# Altium schematic sheet Sheet2.SchDoc
size A3; SheetNumber: 1; SheetTotal: 1
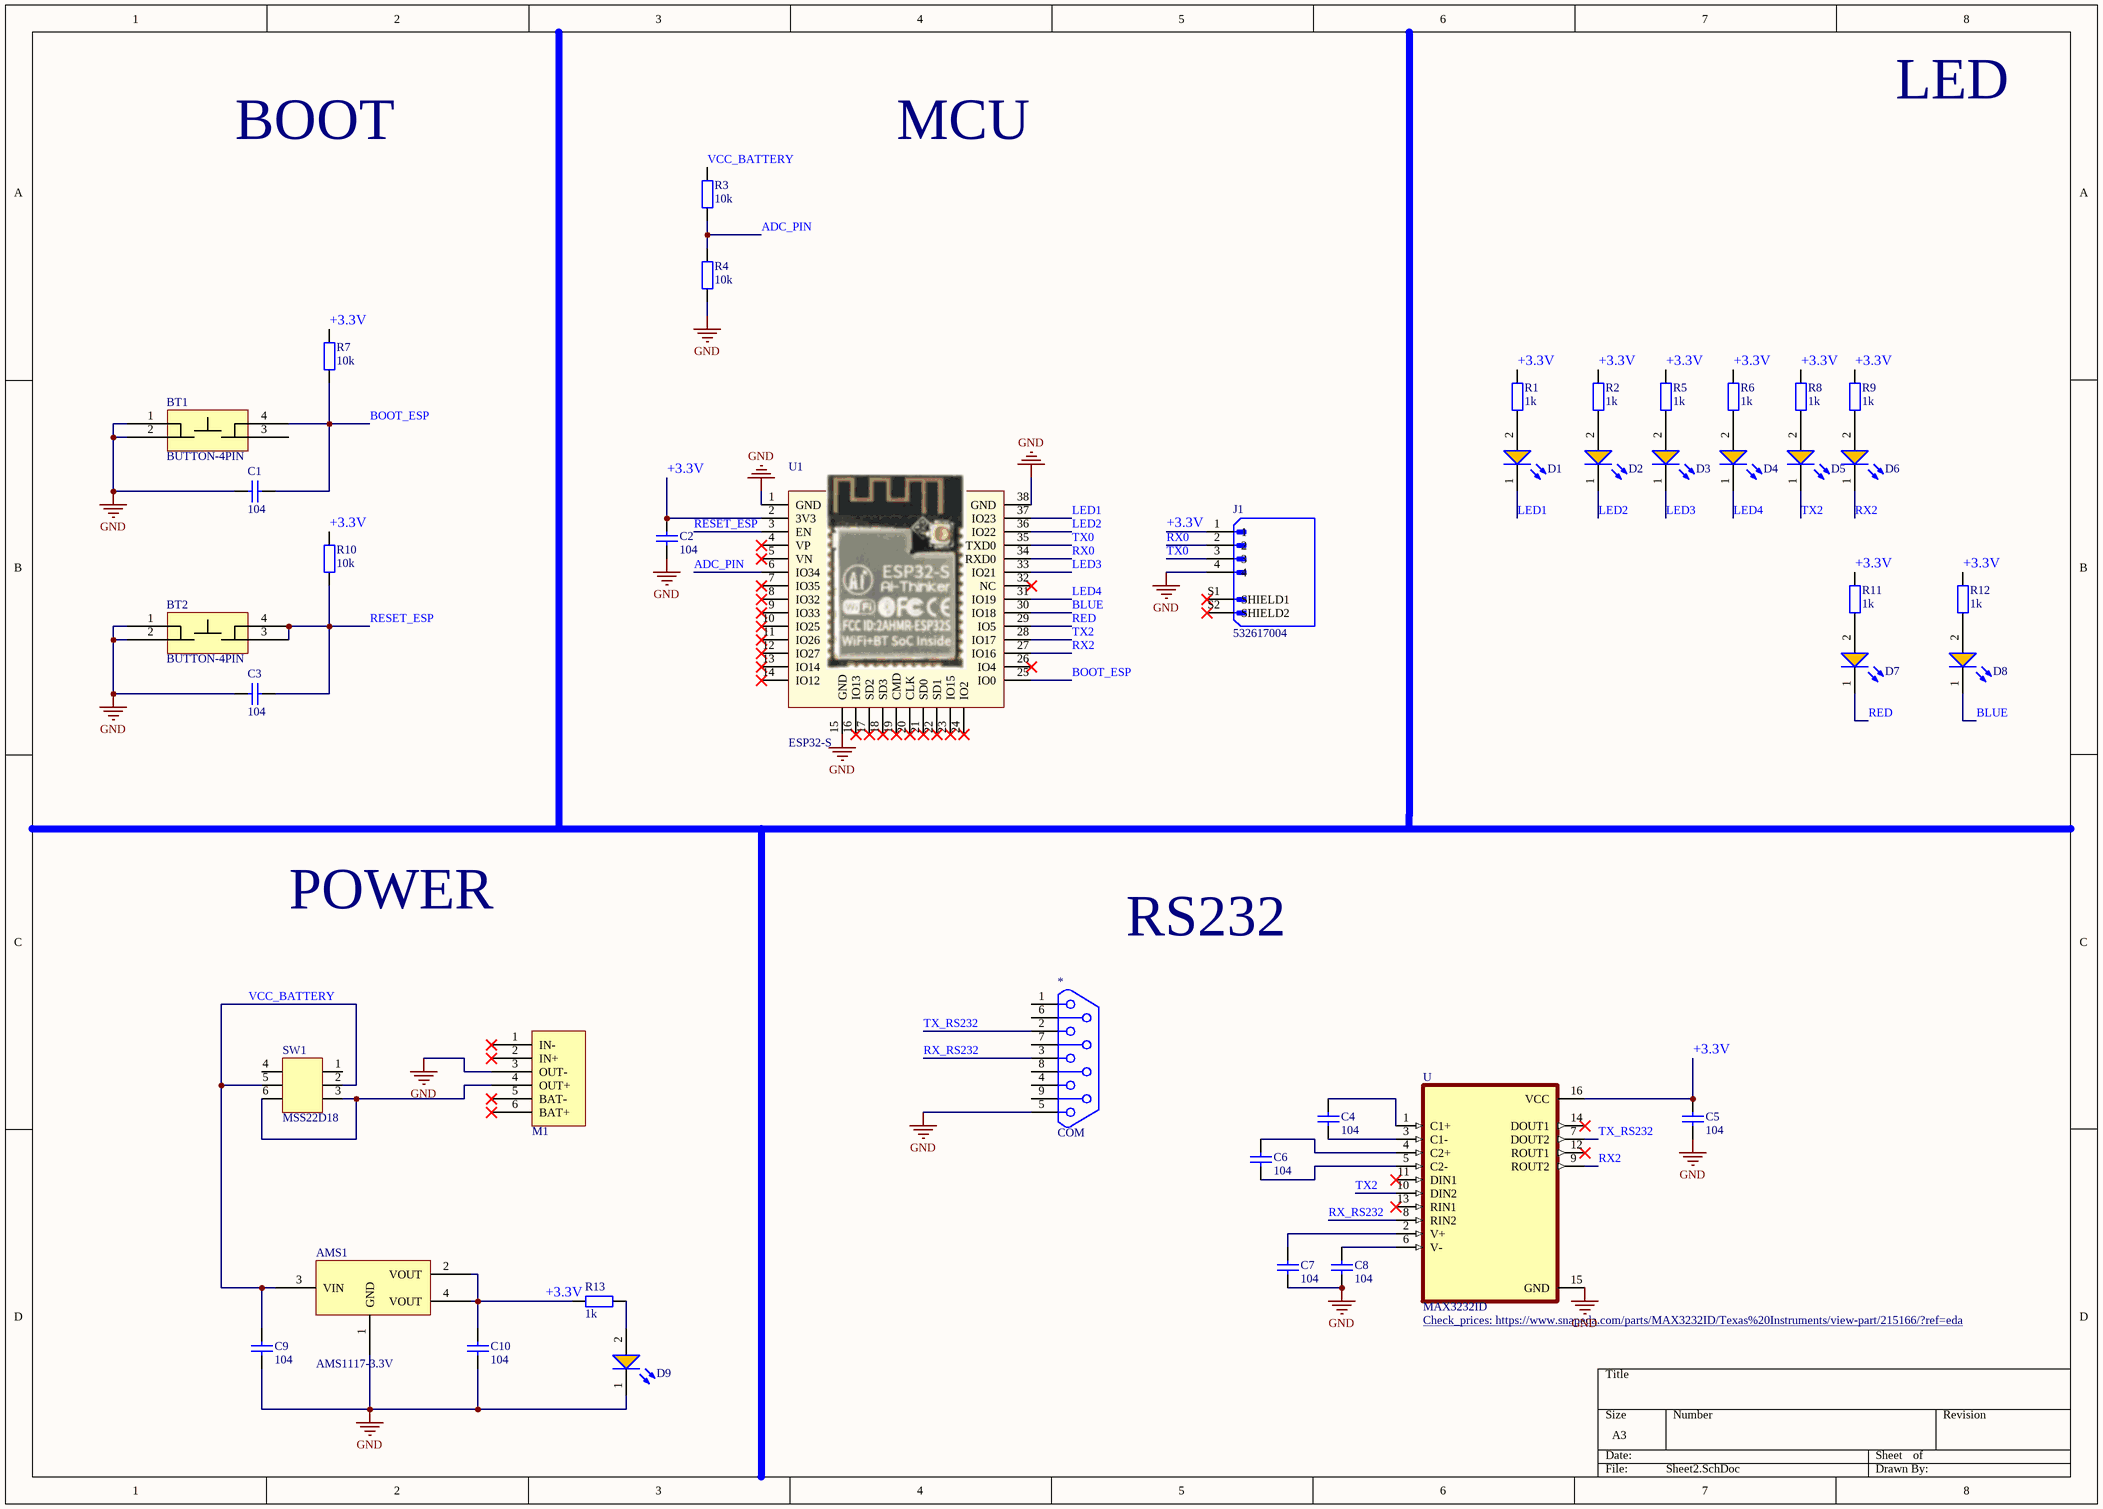
[diagram p0: Sheet2.SchDoc]

## Parts
*  COM  [DSB 9-M]
AMS1  AMS1117-3.3V  [SOT223]
BT1  BUTTON-4PIN  [BUTTON-3X3X1.5-4PIN]
BT2  BUTTON-4PIN  [BUTTON-3X3X1.5-4PIN]
C1  104  [tu 0603]
C2  104  [tu 0603]
C3  104  [tu 0603]
C4  104  [tu 0603]
C5  104  [tu 0603]
C6  104  [tu 0603]
C7  104  [tu 0603]
C8  104  [tu 0603]
C9  104  [tu 0603]
C10  104  [tu 0603]
D1  Amber, 2V, 120°  [WL-SMSW_0603_L1.6W1H0.6]  (value not drawn)
D2  Amber, 2V, 120°  [WL-SMSW_0603_L1.6W1H0.6]  (value not drawn)
D3  Amber, 2V, 120°  [WL-SMSW_0603_L1.6W1H0.6]  (value not drawn)
D4  Amber, 2V, 120°  [WL-SMSW_0603_L1.6W1H0.6]  (value not drawn)
D5  Amber, 2V, 120°  [WL-SMSW_0603_L1.6W1H0.6]  (value not drawn)
D6  Amber, 2V, 120°  [WL-SMSW_0603_L1.6W1H0.6]  (value not drawn)
D7  Amber, 2V, 120°  [WL-SMSW_0603_L1.6W1H0.6]  (value not drawn)
D8  Amber, 2V, 120°  [WL-SMSW_0603_L1.6W1H0.6]  (value not drawn)
D9  Amber, 2V, 120°  [WL-SMSW_0603_L1.6W1H0.6]  (value not drawn)
J1  532617004  [MOLEX_532617004]
M1  MODULE-TP4056  [MODULE-TP4056]  (value not drawn)
R1  1k  [tro smd 0603]
R2  1k  [tro smd 0603]
R3  10k  [Tro SMD 0805]
R4  10k  [Tro SMD 0805]
R5  1k  [tro smd 0603]
R6  1k  [tro smd 0603]
R7  10k  [tro smd 0603]
R8  1k  [tro smd 0603]
R9  1k  [tro smd 0603]
R10  10k  [tro smd 0603]
R11  1k  [tro smd 0603]
R12  1k  [tro smd 0603]
R13  1k  [tro smd 0603]
SW1  MSS22D18  [MSS22D18 SMD]
U  MAX3232ID  [SOIC127P600X175-16N]
U1  ESP32-S  [ESP-32WR]

## Nets
GND: *.5 AMS1.1(GND) BT1.1 BT1.2 BT2.1 BT2.2 C1.1 C2.2 C3.1 C5.2 C7.2 C8.2 C9.2 C10.2 D9.1(K) J1.4 M1.3(OUT-) R4.1 U.15(GND) U1.1(GND) U1.15(GND) U1.38(GND)
+3.3V: AMS1.2(VOUT) AMS1.4(VOUT) C2.1 C5.1 C10.1 J1.1 R1.2 R2.2 R5.2 R6.2 R7.2 R8.2 R9.2 R10.2 R11.2 R12.2 R13.2 U.16(VCC) U1.2(3V3)
ADC_PIN: R3.1 R4.2 U1.6(IO34)
BLUE: D8.1(K) U1.30(IO18)
BOOT_ESP: BT1.4 C1.2 R7.1 U1.25(IO0)
LED1: D1.1(K) U1.37(IO23)
LED2: D2.1(K) U1.36(IO22)
LED3: D3.1(K) U1.33(IO21)
LED4: D4.1(K) U1.31(IO19)
RED: D7.1(K) U1.29(IO5)
RESET_ESP: BT2.3 BT2.4 C3.2 R10.1 U1.3(EN)
RX0: J1.2 U1.34(RXD0)
RX2: D6.1(K) U.9(ROUT2) U1.27(IO16)
RX_RS232: *.3 U.8(RIN2)
TX0: J1.3 U1.35(TXD0)
TX2: D5.1(K) U.10(DIN2) U1.28(IO17)
TX_RS232: *.2 U.7(DOUT2)
VCC_BATTERY: AMS1.3(VIN) C9.1 R3.2 SW1.2 SW1.5
NetC4_1: C4.1 U.1(C1+)
NetC4_2: C4.2 U.3(C1-)
NetC6_1: C6.1 U.4(C2+)
NetC6_2: C6.2 U.5(C2-)
NetC7_1: C7.1 U.2(V+)
NetC8_1: C8.1 U.6(V-)
NetD1_2: D1.2(A) R1.1
NetD2_2: D2.2(A) R2.1
NetD3_2: D3.2(A) R5.1
NetD4_2: D4.2(A) R6.1
NetD5_2: D5.2(A) R8.1
NetD6_2: D6.2(A) R9.1
NetD7_2: D7.2(A) R11.1
NetD8_2: D8.2(A) R12.1
NetD9_2: D9.2(A) R13.1
NetM1_4: M1.4(OUT+) SW1.3 SW1.6

Not connected (* = marked no-connect by the designer): * 1 4 6 7 8 9; BT1 3(14); J1 S1(SHIELD1)* S2(SHIELD2)*; M1 1(IN-)* 2(IN+)* 5(BAT-)* 6(BAT+)*; SW1 1(77) 4; U 11(DIN1)* 12(ROUT1)* 13(RIN1)* 14(DOUT1)*; U1 4(VP)* 5(VN)* 7(IO35)* 8(IO32)* 9(IO33)* 10(IO25)* 11(IO26)* 12(IO27)* 13(IO14)* 14(IO12)* 16(IO13)* 17(SD2)* 18(SD3)* 19(CMD)* 20(CLK)* 21(SD0)* 22(SD1)* 23(IO15)* 24(IO2)* 26(IO4)* 32(NC)*

## Notes on the sheet
- LED
- BOOT
- MCU
- POWER
- RS232

## Library data of the parts
AMS1 = AMS1117 SMD: Dán; Value: AMS1117-3.3V SOT223; Don_Vi: Con; Ma_Hang: MH000596; Ghi_Chu: *; Kieu_Chan: *; Chung_Loai: Dán
C1-C10 = Tu 0603 104 50V 10%: Dán; Don_Vi: Con; So_Chan: 2; Ten_Linh_Kien: Tụ 0603 104-100nF 10% 50V; Ma_Hang: MH004568; Chung_Loai: Dán; Kieu_Chan: *
D1-D9 = 155060AS73200: WL-SMSW Mono-color Side View Waterclear, size 0603, Amber, 2V, 120°; Manufacturer: Wurth Elektronik; Case/Size Code: 0603; Chip Technology: AlInGaP; Dominant Wavelength: 605nm; Luminous Intensity: 120mcd; Peak Wavelength: 609nm; Manufacturer Part Number: 155060AS73200; Category: Signal LEDs; Match Code: WL-SMSW; ComponentLink1Description: Website Link; ComponentLink1URL: https://www.we-online.com/redexpert/article/155060AS73200?ad; ComponentLink2Description: Datasheet Link; ComponentLink2URL: https://www.we-online.com/redexpert/spec/155060AS73200?ad; Mount: Surface Mount; Operating Temperature Max: 85°C; Operating Temperature Min: -40°C; Packaging: Tape and Reel; Length: 1.6mm; Width: 1mm; Height: 0.6mm; Emitting Color: Amber; Forward Voltage: 2V; Viewing Angle: 120°
R1 R2 R5-R13 = Tro 0603 5% 1k: Dán; Don_Vi: Con; So_Chan: 2; Ten_Linh_Kien: Trở 0603 5% 1k; Ma_Hang: MH006319; Chung_Loai: Dán; Kieu_Chan: *
R3 R4 = Tro 0805 5% 82k: Dán; Don_Vi: Con; So_Chan: 2; Ten_Linh_Kien: Trở 0805 5% 82k; Ma_Hang: MH005329; Chung_Loai: Dán; Kieu_Chan: *
SW1 = MSS22D18: SMD
U = MAX3232ID: 3-V to 5.5-V multichannel RS-232 line driver & receiver 16-SOIC -40 to 85; MF: Texas Instruments; Price: None; Value: *; Package: SOIC-16 Texas Instruments; Mouser-Purchase-URL: https://snapeda.com/shop?store=Mouser&id=215166; SnapEDA_Link: https://www.snapeda.com/parts/MAX3232ID/Texas%20Instruments/view-part/215166/?ref=snap; DigiKey-Purchase-URL: https://snapeda.com/shop?store=DigiKey&id=215166; MP: MAX3232ID; Texas_Instruments-Purchase-URL: https://snapeda.com/shop?store=Texas+Instruments&id=215166; Availability: Good; Check_prices: https://www.snapeda.com/parts/MAX3232ID/Texas%20Instruments/view-part/215166/?ref=eda
J1 = 532617004: Availability: Unavailable; MP: 532617004; Package: None; Price: None; Value: *